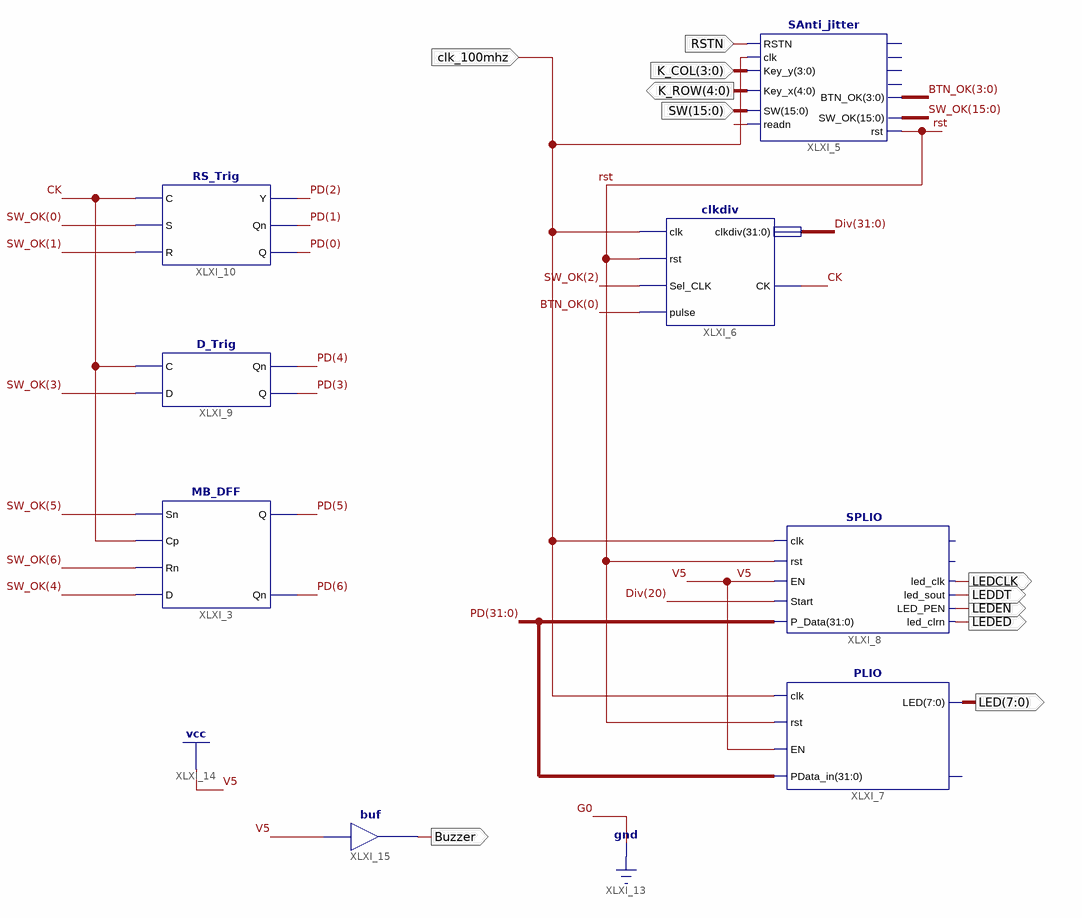
[diagram p0: schematic sheet 1]
// Xilinx ISE schematic Top.sch (kintex7) as structural Verilog: 8 symbols, 11 ports
module Top (
  input  clk_100mhz,
  input  [15:0] SW,
  input  [3:0] K_COL,
  input  RSTN,
  output [4:0] K_ROW,
  output [7:0] LED,
  output LEDCLK,
  output LEDED,
  output LEDEN,
  output LEDDT,
  output Buzzer
);

  wire CK, rst, XLXN_3;
  wire [3:0] BTN_OK;
  wire [15:0] SW_OK;
  wire [31:0] Div, PD;

  MB_DFF XLXI_3 (.Sn(SW_OK[5]), .Cp(CK), .Rn(SW_OK[6]), .D(SW_OK[4]), .Q(PD[5]), .Qn(PD[6]));
  SAnti_jitter XLXI_5 (
    .SW(SW), .readn(XLXN_3), .Key_y(K_COL), .Key_x(K_ROW), .RSTN(RSTN), .clk(clk_100mhz), .rst(rst),
    .SW_OK(SW_OK), .BTN_OK(BTN_OK));  // open: Key_out, Key_ready, CR, pulse_out
  clkdiv XLXI_6 (.clk(clk_100mhz), .rst(rst), .clkdiv(Div), .Sel_CLK(SW_OK[2]), .pulse(BTN_OK[0]), .CK(CK));
  PLIO XLXI_7 (.clk(clk_100mhz), .rst(rst), .EN(1'b1), .PData_in(PD), .LED(LED));  // open: GPIOf0
  SPLIO XLXI_8 (
    .clk(clk_100mhz), .P_Data(PD), .rst(rst), .EN(1'b1), .Start(Div[20]), .led_clk(LEDCLK), .led_clrn(LEDED),
    .LED_PEN(LEDEN), .led_sout(LEDDT));  // open: LED, GPIOf0
  D_Trig XLXI_9 (.C(CK), .D(SW_OK[3]), .Qn(PD[4]), .Q(PD[3]));
  RS_Trig XLXI_10 (.C(CK), .S(SW_OK[0]), .R(SW_OK[1]), .Y(PD[2]), .Qn(PD[1]), .Q(PD[0]));
  buf XLXI_15 (Buzzer, 1'b1);
endmodule
